# Altium project RPi.PrjPcb
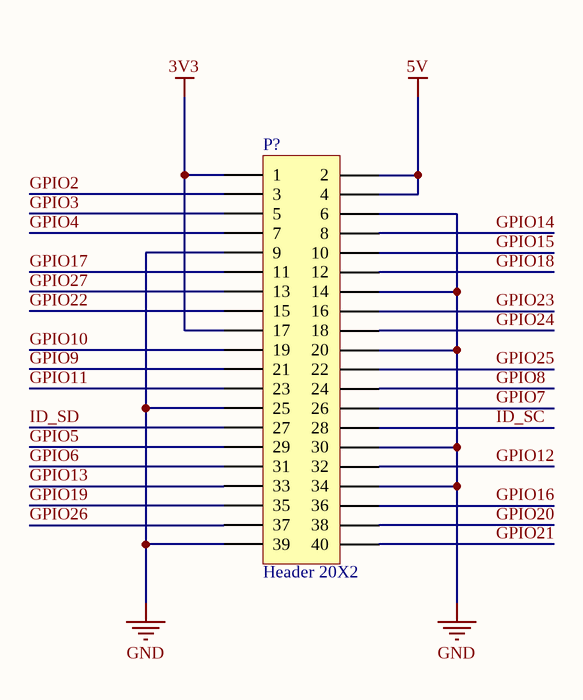
[diagram p0: RPi-Header.SchDoc]
1 sheet, 1 parts. Net scope: global (net labels, ports and power ports of the same name join across sheets).
Board file: PCB1.PcbDoc

## Sheet RPi-Header.SchDoc
size A

### Parts
P?  Header 20X2  [HDR2X20]

### Nets
3V3: P?.1 P?.17
5V: P?.2 P?.4
GND: P?.6 P?.9 P?.14 P?.20 P?.25 P?.30 P?.34 P?.39
GPIO2: P?.3
GPIO3: P?.5
GPIO4: P?.7
GPIO5: P?.29
GPIO6: P?.31
GPIO7: P?.26
GPIO8: P?.24
GPIO9: P?.21
GPIO10: P?.19
GPIO11: P?.23
GPIO12: P?.32
GPIO13: P?.33
GPIO14: P?.8
GPIO15: P?.10
GPIO16: P?.36
GPIO17: P?.11
GPIO18: P?.12
GPIO19: P?.35
GPIO20: P?.38
GPIO21: P?.40
GPIO22: P?.15
GPIO23: P?.16
GPIO24: P?.18
GPIO25: P?.22
GPIO26: P?.37
GPIO27: P?.13
ID_SC: P?.28
ID_SD: P?.27

### Library data of the parts
P? = Header 20X2: Header, 20-Pin, Dual row; LatestRevisionDate: 17-Jul-2002; LatestRevisionNote: Re-released for DXP Platform.; Publisher: Altium Limited